# EAGLE design untitled (EAGLE 9.6.2)
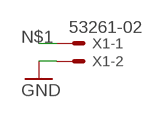
[diagram p0: schematic, sheet 1]

## Parts
X1  53261-02  [53261-02]

## Nets
GND: X1.2
N$1: X1.1

## Library data of the parts
X1 = con-molex:53?-02: CONNECTOR wire to board 1.25 mm (.049 inch) pitch header; MF: MOLEX; OC_FARNELL: 1125373; OC_NEWARK: unknown

## Board
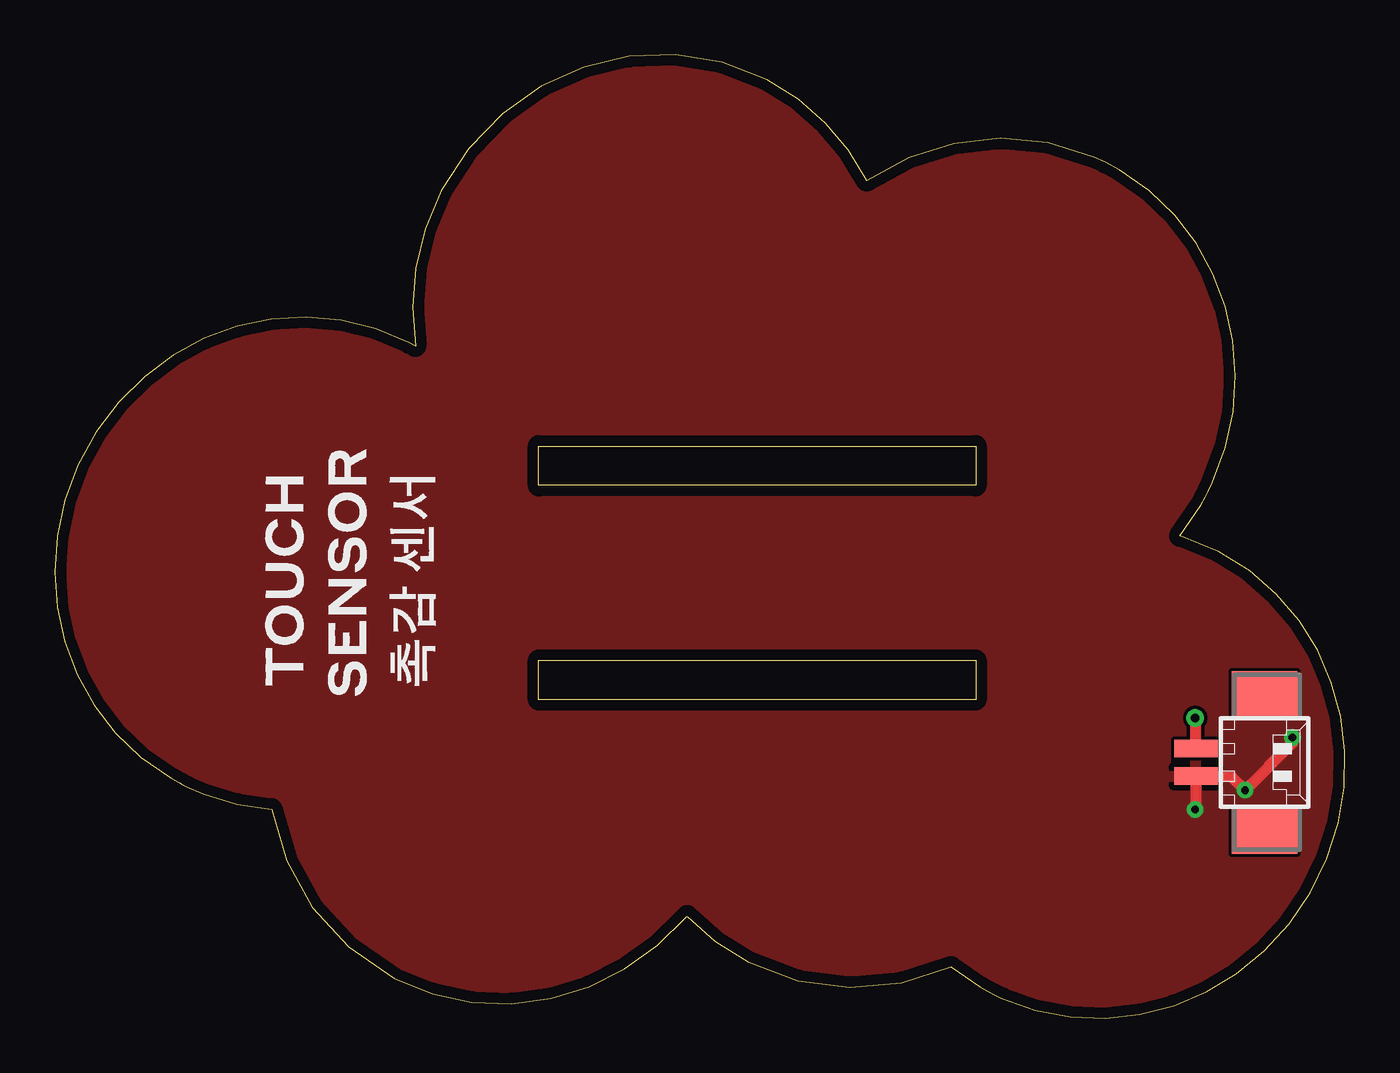
[diagram p1: board, top side]
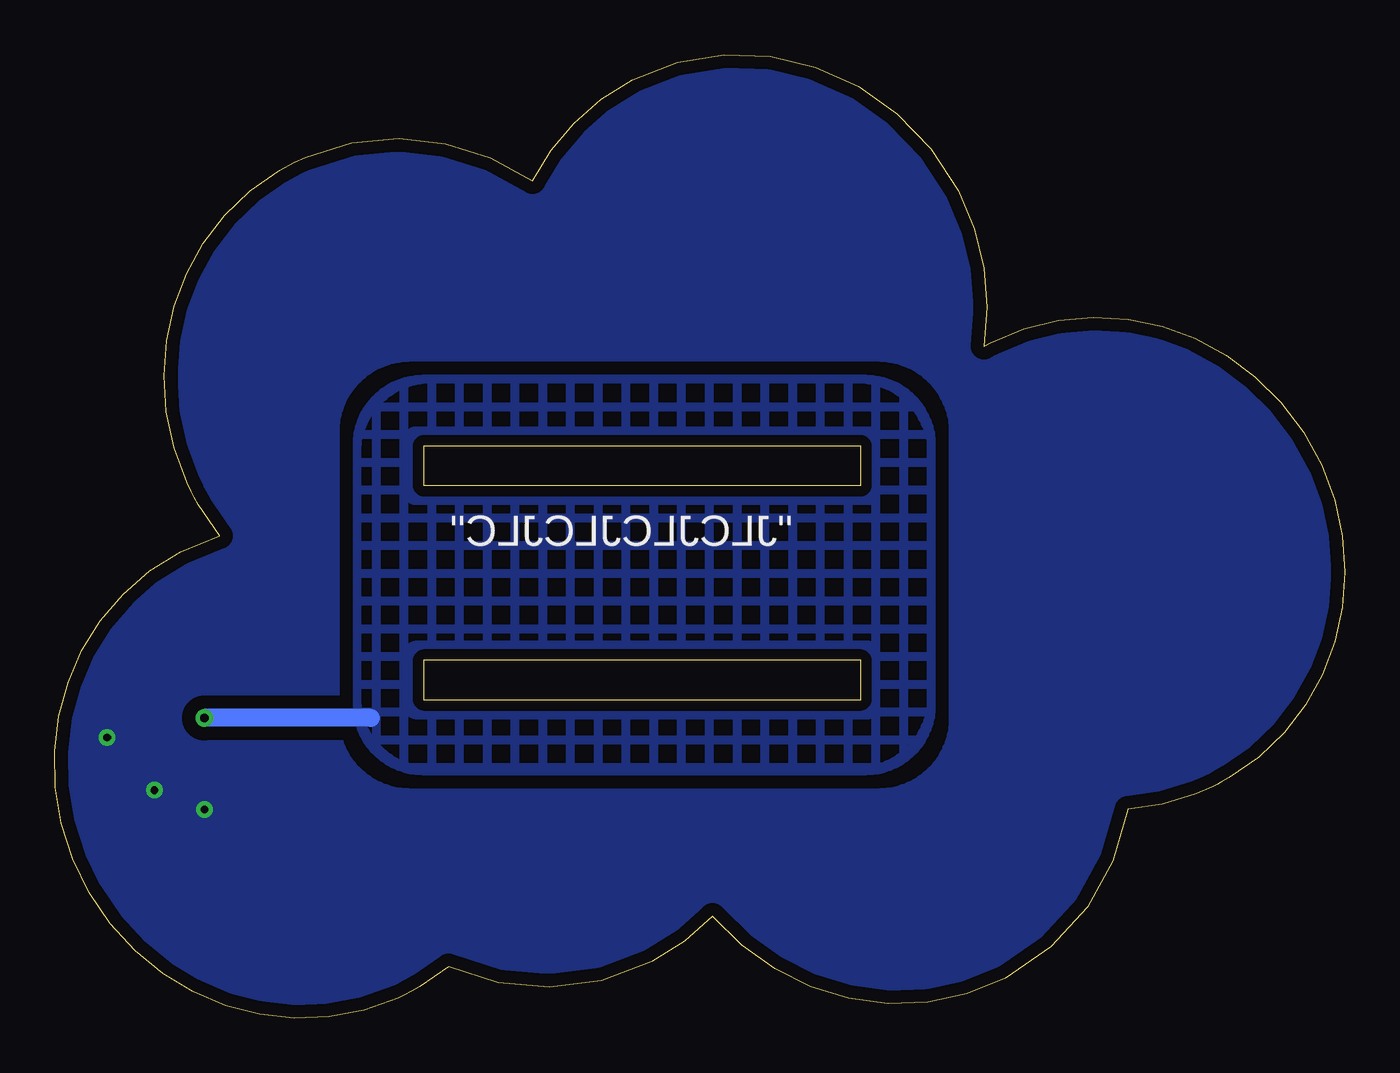
[diagram p2: board, bottom side, seen from below]

Size 59.03 x 44.07 mm. Coordinates in mm from the lower left corner, seen from the top.
Outline: 22.15,26.17 42.15,26.17 42.15,24.37 22.15,24.37 22.15,26.17
Outline: 42.15,14.57 22.15,14.57 22.15,16.37 42.15,16.37 42.15,14.57
Outline: 37.17,38.32 36.32,39.7 35.28,40.94 34.03,42.02 32.6,42.92 30.54,43.72 28.42,44.08 26.29,44 24.22,43.51 22.26,42.63 20.48,41.37 18.94,39.77 17.69,37.84 16.96,36.1 16.52,34.31 16.37,32.52 16.5,30.75 16.23,30.9 14.69,31.54 13.11,31.93 11.51,32.08 9.92,31.98 8.36,31.65 6.85,31.09 5.43,30.33 4.11,29.35 2.93,28.18 1.9,26.83 1.06,25.3 0.46,23.69 0.11,22.05 0,20.41 0.12,18.79 0.47,17.22 1.03,15.72 1.8,14.33 2.78,13.06 3.94,11.94 5.3,10.99 5.67,10.79 5.85,10.69 6.04,10.6 6.8,10.26 8.34,9.79 9.92,9.57 10.61,7.22 11.79,5.08 13.44,3.26 15.53,1.84 17.28,1.13 19.09,0.74 20.9,0.67 22.7,0.91 24.44,1.45 26.08,2.26 27.6,3.34 28.94,4.67 30.22,3.53 31.72,2.59 34.02,1.72 36.39,1.41 38.75,1.63 41.01,2.36 42.34,1.44 42.7,1.24 42.79,1.19 42.95,1.11 43.33,0.93 44.88,0.37 46.47,0.06 48.07,0 49.66,0.18 51.2,0.58 52.68,1.21 54.07,2.04 55.35,3.08 56.48,4.32 57.45,5.74 58.21,7.31 58.73,8.93 59,10.57 59.03,12.2 58.84,13.81 58.42,15.36 57.79,16.82 56.95,18.18 55.91,19.4 54.67,20.47 53.26,21.35 51.49,22.07 52.44,23.46 52.65,23.84 52.7,23.93 52.78,24.1 52.97,24.49 53.57,26.1 53.92,27.74 54.03,29.38 53.91,31 53.56,32.57 53,34.06 52.23,35.46 51.26,36.73 50.09,37.85 48.73,38.8 48.07,39.15 47.56,39.39 45.44,40.05 43.28,40.25 41.14,40.01 39.08,39.36 37.17,38.32
Copper layers (1*16): Top 0.035mm / dielectric 1.5mm / Bottom 0.035mm
Design rules "default *": minimum track width 6mil, minimum drill 0.35mm, track to track 6mil, track to pad 6mil, pad to pad 6mil, via to via 6mil, smd to smd 6mil, copper to edge 20mil, drill to drill 6mil, minimum pad ring 10mil, minimum via ring 8mil, stop-mask expansion 4mil, vias tented up to drill 20mil, thermal gap 10mil

### Footprints (pad centres in the part's own frame; a part is rotated, then mirrored left to right if it is on the bottom)
53261-02 = smd 0.8 x 2: 1 0.625,-2.5; 2 -0.625,-2.5 | smd 2.1 x 3: S1 3.125,0.625; S2 -3.125,0.625

### Placement (x,y rotation side)
X1  54.73,11.7 270 top

### Tracks (layer width: path | path; a pad name or v marks a point on that pad's centre or on a via)
GND  (via drill 0.39)
  Top 0.508: X1.2 52.23,13.7 v52.19,13.74
  Bottom 0.813: 44.57,13.74 v52.19,13.74
  pour Bottom (isolate 0.406, hatched): 21.91,29.22 42.2,29.22 arc-90 45.2,26.22 45.2,14.32 arc-90 42.2,11.32 21.91,11.32 arc-90 18.91,14.32 18.91,26.22 arc-90
N$1  (via drill 0.35)
  Top 0.508: v52.19,9.54 52.23,9.58 X1.1 53.83,11.08 v54.47,10.43 56.63,12.59 v56.63,12.85
  pour Top (rank 2): -1.41,-1.25 -1.41,47.01 62.09,47.01 62.09,-2.52
  pour Bottom (isolate 0.61, rank 2): -1.41,0.02 -1.41,48.28 62.09,48.28 62.09,-1.25

### Text on the board
bPlace: "JLCJLCJLCJLC"